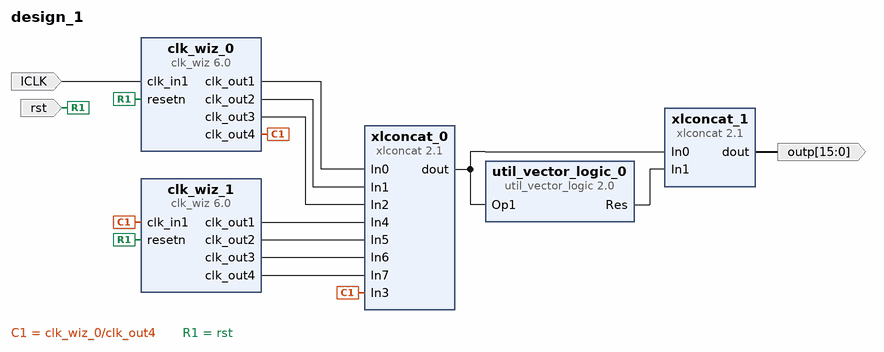
[diagram p0: block diagram of the top level]
# Vivado block design design_1, xc7z020clg400-1, Vivado 2019.1
create_bd_design design_1

create_bd_port -dir I ICLK
create_bd_port -dir O -from 15 -to 0 outp
create_bd_port -dir I -type rst rst

create_bd_cell -type ip -vlnv xilinx.com:ip:clk_wiz:6.0 clk_wiz_0
set_property -dict [list \
  CONFIG.CLKOUT1_JITTER 130.958 \
  CONFIG.CLKOUT1_PHASE_ERROR 98.575 \
  CONFIG.CLKOUT1_REQUESTED_PHASE 022.5 \
  CONFIG.CLKOUT2_JITTER 130.958 \
  CONFIG.CLKOUT2_PHASE_ERROR 98.575 \
  CONFIG.CLKOUT2_REQUESTED_PHASE 45 \
  CONFIG.CLKOUT2_USED true \
  CONFIG.CLKOUT3_JITTER 130.958 \
  CONFIG.CLKOUT3_PHASE_ERROR 98.575 \
  CONFIG.CLKOUT3_REQUESTED_PHASE 67.5 \
  CONFIG.CLKOUT3_USED true \
  CONFIG.CLKOUT4_JITTER 130.958 \
  CONFIG.CLKOUT4_PHASE_ERROR 98.575 \
  CONFIG.CLKOUT4_REQUESTED_PHASE 90 \
  CONFIG.CLKOUT4_USED true \
  CONFIG.JITTER_SEL Min_O_Jitter \
  CONFIG.MMCM_BANDWIDTH HIGH \
  CONFIG.MMCM_CLKFBOUT_MULT_F 10.000 \
  CONFIG.MMCM_CLKOUT0_DIVIDE_F 10.000 \
  CONFIG.MMCM_CLKOUT0_PHASE 22.500 \
  CONFIG.MMCM_CLKOUT1_DIVIDE 10 \
  CONFIG.MMCM_CLKOUT1_PHASE 45.000 \
  CONFIG.MMCM_CLKOUT2_DIVIDE 10 \
  CONFIG.MMCM_CLKOUT2_PHASE 67.500 \
  CONFIG.MMCM_CLKOUT3_DIVIDE 10 \
  CONFIG.MMCM_CLKOUT3_PHASE 90.000 \
  CONFIG.NUM_OUT_CLKS 4 \
  CONFIG.PRIM_IN_FREQ 100.000 \
  CONFIG.RESET_PORT resetn \
  CONFIG.RESET_TYPE ACTIVE_LOW \
  CONFIG.USE_LOCKED false \
] [get_bd_cells clk_wiz_0]
create_bd_cell -type ip -vlnv xilinx.com:ip:clk_wiz:6.0 clk_wiz_1
set_property -dict [list \
  CONFIG.CLKOUT1_JITTER 130.958 \
  CONFIG.CLKOUT1_PHASE_ERROR 98.575 \
  CONFIG.CLKOUT1_REQUESTED_PHASE 022.5 \
  CONFIG.CLKOUT2_JITTER 130.958 \
  CONFIG.CLKOUT2_PHASE_ERROR 98.575 \
  CONFIG.CLKOUT2_REQUESTED_PHASE 45 \
  CONFIG.CLKOUT2_USED true \
  CONFIG.CLKOUT3_JITTER 130.958 \
  CONFIG.CLKOUT3_PHASE_ERROR 98.575 \
  CONFIG.CLKOUT3_REQUESTED_PHASE 67.5 \
  CONFIG.CLKOUT3_USED true \
  CONFIG.CLKOUT4_JITTER 130.958 \
  CONFIG.CLKOUT4_PHASE_ERROR 98.575 \
  CONFIG.CLKOUT4_REQUESTED_PHASE 90 \
  CONFIG.CLKOUT4_USED true \
  CONFIG.JITTER_SEL Min_O_Jitter \
  CONFIG.MMCM_BANDWIDTH HIGH \
  CONFIG.MMCM_CLKFBOUT_MULT_F 10.000 \
  CONFIG.MMCM_CLKOUT0_DIVIDE_F 10.000 \
  CONFIG.MMCM_CLKOUT0_PHASE 22.500 \
  CONFIG.MMCM_CLKOUT1_DIVIDE 10 \
  CONFIG.MMCM_CLKOUT1_PHASE 45.000 \
  CONFIG.MMCM_CLKOUT2_DIVIDE 10 \
  CONFIG.MMCM_CLKOUT2_PHASE 67.500 \
  CONFIG.MMCM_CLKOUT3_DIVIDE 10 \
  CONFIG.MMCM_CLKOUT3_PHASE 90.000 \
  CONFIG.NUM_OUT_CLKS 4 \
  CONFIG.PRIM_IN_FREQ 100.000 \
  CONFIG.RESET_PORT resetn \
  CONFIG.RESET_TYPE ACTIVE_LOW \
  CONFIG.USE_LOCKED false \
] [get_bd_cells clk_wiz_1]
create_bd_cell -type ip -vlnv xilinx.com:ip:util_vector_logic:2.0 util_vector_logic_0
set_property -dict {CONFIG.C_OPERATION not} [get_bd_cells util_vector_logic_0]
create_bd_cell -type ip -vlnv xilinx.com:ip:xlconcat:2.1 xlconcat_0
set_property -dict {CONFIG.NUM_PORTS 8} [get_bd_cells xlconcat_0]
create_bd_cell -type ip -vlnv xilinx.com:ip:xlconcat:2.1 xlconcat_1
set_property -dict {CONFIG.IN0_WIDTH 8 CONFIG.IN1_WIDTH 8} [get_bd_cells xlconcat_1]

# ---- connections ----

connect_bd_net [get_bd_pins clk_wiz_0/clk_out4] [get_bd_pins clk_wiz_1/clk_in1] [get_bd_pins xlconcat_0/In3]
connect_bd_net [get_bd_ports rst] [get_bd_pins clk_wiz_1/resetn] [get_bd_pins clk_wiz_0/resetn]
connect_bd_net [get_bd_ports ICLK] [get_bd_pins clk_wiz_0/clk_in1]
connect_bd_net [get_bd_pins clk_wiz_0/clk_out1] [get_bd_pins xlconcat_0/In0]
connect_bd_net [get_bd_pins clk_wiz_0/clk_out2] [get_bd_pins xlconcat_0/In1]
connect_bd_net [get_bd_pins clk_wiz_0/clk_out3] [get_bd_pins xlconcat_0/In2]
connect_bd_net [get_bd_pins clk_wiz_1/clk_out1] [get_bd_pins xlconcat_0/In4]
connect_bd_net [get_bd_pins clk_wiz_1/clk_out2] [get_bd_pins xlconcat_0/In5]
connect_bd_net [get_bd_pins clk_wiz_1/clk_out3] [get_bd_pins xlconcat_0/In6]
connect_bd_net [get_bd_pins clk_wiz_1/clk_out4] [get_bd_pins xlconcat_0/In7]
connect_bd_net [get_bd_pins xlconcat_0/dout] [get_bd_pins util_vector_logic_0/Op1] [get_bd_pins xlconcat_1/In0]
connect_bd_net [get_bd_pins util_vector_logic_0/Res] [get_bd_pins xlconcat_1/In1]
connect_bd_net [get_bd_pins xlconcat_1/dout] [get_bd_ports outp]

validate_bd_design
save_bd_design
